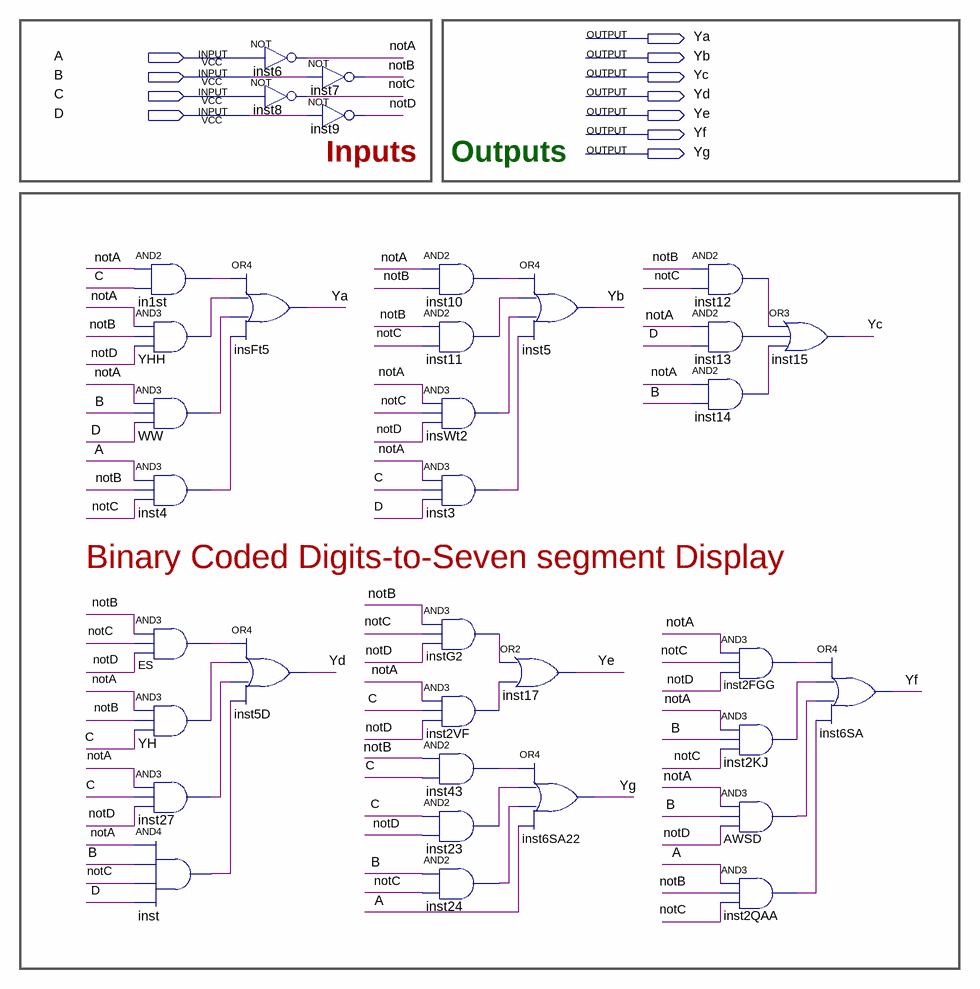
[diagram p0: schematic sheet]
// Quartus schematic BCD4SSD.bdf as structural Verilog: 35 symbols, 11 pins
module BCD4SSD (
  input  A,
  input  B,
  input  C,
  input  D,
  output Ya,
  output Yb,
  output Yc,
  output Yd,
  output Ye,
  output Yf,
  output Yg
);

  wire AWSD_out, ES_out, in1st_out, inst2FGG_out, inst2KJ_out, inst2QAA_out, inst2VF_out, inst3_out,
       inst4_out, inst10_out, inst11_out, inst12_out, inst13_out, inst14_out, inst23_out, inst24_out,
       inst27_out, inst43_out, inst_out, instG2_out, insWt2_out, notA, notB, notC, notD, WW_out, YH_out,
       YHH_out;

  and in1st (in1st_out, notA, C);
  and YHH (YHH_out, notA, notB, notD);
  and WW (WW_out, notA, B, D);
  and inst4 (inst4_out, A, notB, notC);
  and ES (ES_out, notB, notC, notD);
  and YH (YH_out, notA, notB, C);
  and inst27 (inst27_out, notA, C, notD);
  and inst (inst_out, notA, B, notC, D);
  not inst6 (notA, A);
  not inst8 (notC, C);
  or insFt5 (Ya, in1st_out, YHH_out, WW_out, inst4_out);
  or inst5D (Yd, ES_out, YH_out, inst27_out, inst_out);
  not inst7 (notB, B);
  not inst9 (notD, D);
  and inst10 (inst10_out, notA, notB);
  and inst11 (inst11_out, notB, notC);
  and insWt2 (insWt2_out, notA, notC, notD);
  and inst3 (inst3_out, notA, C, D);
  and instG2 (instG2_out, notB, notC, notD);
  and inst2VF (inst2VF_out, notA, C, notD);
  and inst43 (inst43_out, notB, C);
  and inst23 (inst23_out, C, notD);
  and inst24 (inst24_out, B, notC);
  or inst5 (Yb, inst10_out, inst11_out, insWt2_out, inst3_out);
  or inst17 (Ye, instG2_out, inst2VF_out);
  or inst6SA22 (Yg, inst43_out, inst23_out, inst24_out, A);
  and inst12 (inst12_out, notB, notC);
  and inst13 (inst13_out, notA, D);
  and inst14 (inst14_out, notA, B);
  and inst2FGG (inst2FGG_out, notA, notC, notD);
  and inst2KJ (inst2KJ_out, notA, B, notC);
  and AWSD (AWSD_out, notA, B, notD);
  and inst2QAA (inst2QAA_out, A, notB, notC);
  or inst15 (Yc, inst12_out, inst13_out, inst14_out);
  or inst6SA (Yf, inst2FGG_out, inst2KJ_out, AWSD_out, inst2QAA_out);

  // Notes on the sheet:
  //   Inputs
  //   Outputs
  //   Binary Coded Digits-to-Seven segment Display
endmodule
